# Altium schematic sheet top.SchDoc
size A3
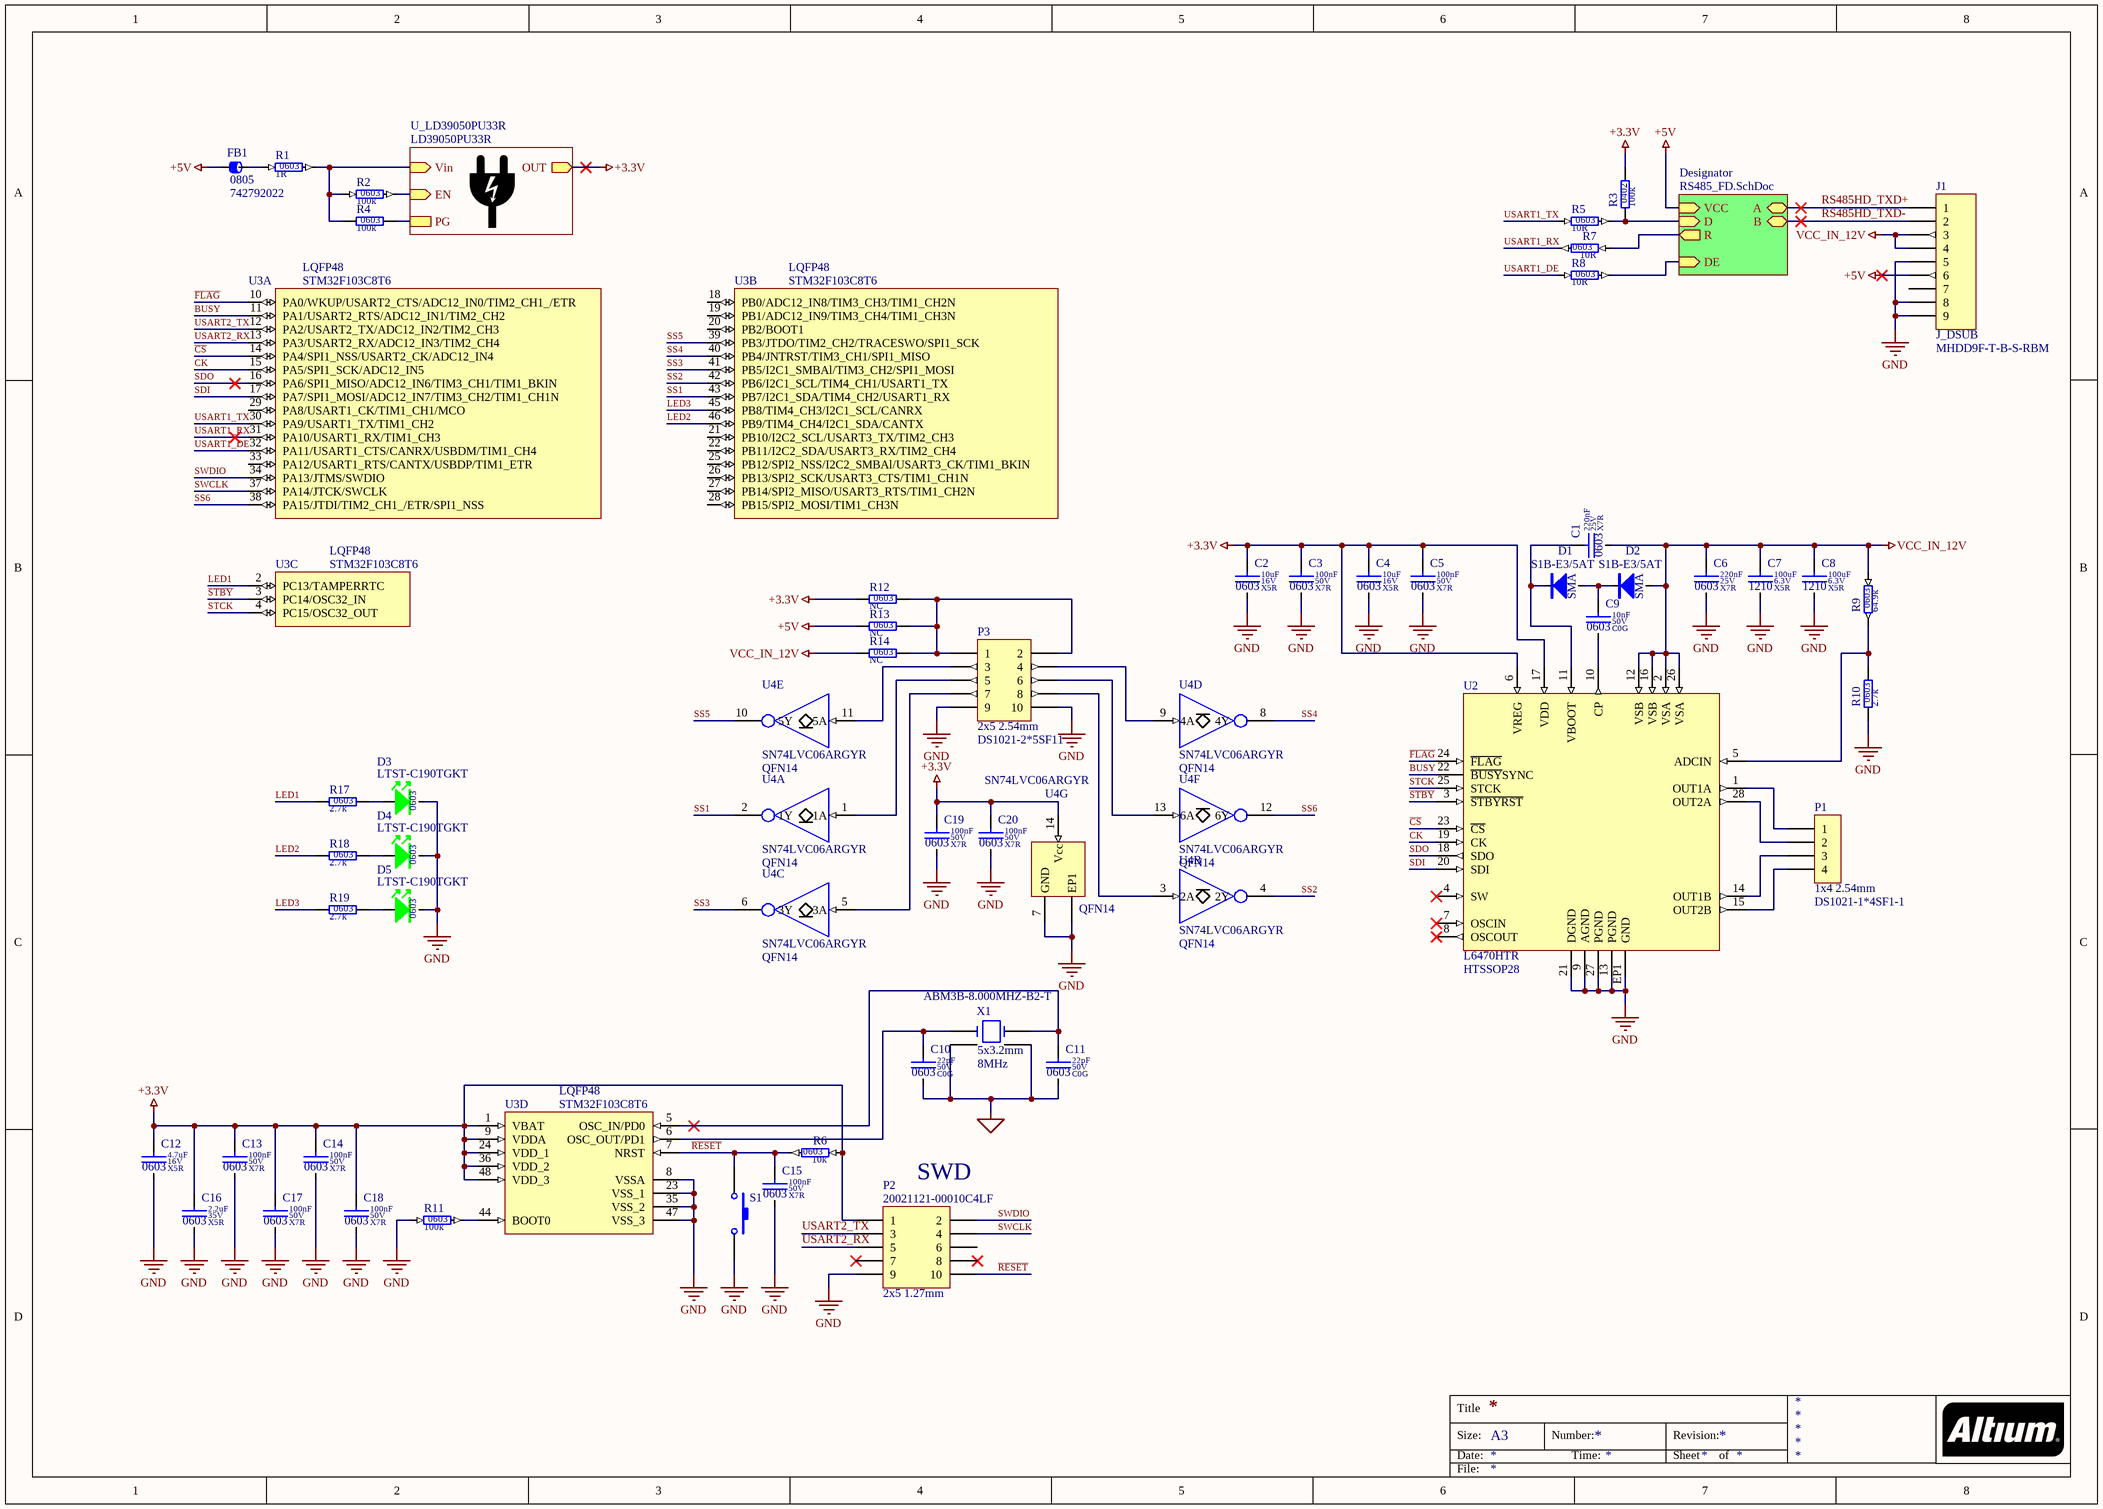
[diagram p0: top.SchDoc]

## Parts
C1  value 220nF  Dielectric: X7R  Voltage: 25V  SCH_Footprint: 0603  [C_0603_1608]  (hidden comment: Ceramic X7R)
C2  value 10uF  Dielectric: X5R  Voltage: 16V  SCH_Footprint: 0603  [C_0603_1608]  (hidden comment: Ceramic X5R)
C3  value 100nF  Dielectric: X7R  Voltage: 50V  SCH_Footprint: 0603  [C_0603_1608]  (hidden comment: Ceramic X7R)
C4  value 10uF  Dielectric: X5R  Voltage: 16V  SCH_Footprint: 0603  [C_0603_1608]  (hidden comment: Ceramic X5R)
C5  value 100nF  Dielectric: X7R  Voltage: 50V  SCH_Footprint: 0603  [C_0603_1608]  (hidden comment: Ceramic X7R)
C6  value 220nF  Dielectric: X7R  Voltage: 25V  SCH_Footprint: 0603  [C_0603_1608]  (hidden comment: Ceramic X7R)
C7  value 100uF  Dielectric: X5R  Voltage: 6.3V  SCH_Footprint: 1210  [C_1210_3225]  (hidden comment: Ceramic X5R)
C8  value 100uF  Dielectric: X5R  Voltage: 6.3V  SCH_Footprint: 1210  [C_1210_3225]  (hidden comment: Ceramic X5R)
C9  value 10nF  Dielectric: C0G  Voltage: 50V  SCH_Footprint: 0603  [C_0603_1608]  (hidden comment: Ceramic C0G)
C10  value 22pF  Dielectric: C0G  Voltage: 50V  SCH_Footprint: 0603  [C_0603_1608]  (hidden comment: Ceramic C0G)
C11  value 22pF  Dielectric: C0G  Voltage: 50V  SCH_Footprint: 0603  [C_0603_1608]  (hidden comment: Ceramic C0G)
C12  value 4.7uF  Dielectric: X5R  Voltage: 16V  SCH_Footprint: 0603  [C_0603_1608]  (hidden comment: Ceramic X5R)
C13  value 100nF  Dielectric: X7R  Voltage: 50V  SCH_Footprint: 0603  [C_0603_1608]  (hidden comment: Ceramic X7R)
C14  value 100nF  Dielectric: X7R  Voltage: 50V  SCH_Footprint: 0603  [C_0603_1608]  (hidden comment: Ceramic X7R)
C15  value 100nF  Dielectric: X7R  Voltage: 50V  SCH_Footprint: 0603  [C_0603_1608]  (hidden comment: Ceramic X7R)
C16  value 2.2uF  Dielectric: X5R  Voltage: 35V  SCH_Footprint: 0603  [C_0603_1608]  (hidden comment: Ceramic X5R)
C17  value 100nF  Dielectric: X7R  Voltage: 50V  SCH_Footprint: 0603  [C_0603_1608]  (hidden comment: Ceramic X7R)
C18  value 100nF  Dielectric: X7R  Voltage: 50V  SCH_Footprint: 0603  [C_0603_1608]  (hidden comment: Ceramic X7R)
C19  value 100nF  Dielectric: X7R  Voltage: 50V  SCH_Footprint: 0603  [C_0603_1608]  (hidden comment: Ceramic X7R)
C20  value 100nF  Dielectric: X7R  Voltage: 50V  SCH_Footprint: 0603  [C_0603_1608]  (hidden comment: Ceramic X7R)
D1  value S1B-E3/5AT  SCH_Footprint: SMA  [SMA_DO-214AC]  (hidden comment: S1B-E3)
D2  value S1B-E3/5AT  SCH_Footprint: SMA  [SMA_DO-214AC]  (hidden comment: S1B-E3)
D3  value LTST-C190TGKT  SCH_Footprint: 0603  [OL_0603_1608]  (hidden comment: Green Led)
D4  value LTST-C190TGKT  SCH_Footprint: 0603  [OL_0603_1608]  (hidden comment: Green Led)
D5  value LTST-C190TGKT  SCH_Footprint: 0603  [OL_0603_1608]  (hidden comment: Green Led)
FB1  value 742792022  SCH_Footprint: 0805  [FB_0805_2012]  (hidden comment: Ferrite bead)
J1  value MHDD9F-T-B-S-RBM  [J_DSUB_MHDD9F-T-B-S-RBM]  (hidden comment: DSUB 9 Pin)
P1  value DS1021-1*4SF1-1  SCH_Footprint: 1x4 2.54mm  [P_HEADER_1x4_2.54]  (hidden comment: Goldpin)
P2  value 20021121-00010C4LF  SCH_Footprint: 2x5 1.27mm  [P_HEADER_2x5_1.27]  (hidden comment: Jtag)
P3  value DS1021-2*5SF11  SCH_Footprint: 2x5 2.54mm  [P_HEADER_2x5_2.54]  (hidden comment: Goldpin male)
R1  value 1R  SCH_Footprint: 0603  [R_0603_1608]  (hidden comment: Resistor)
R2  value 100k  SCH_Footprint: 0603  [R_0603_1608]  (hidden comment: Resistor)
R3  value 100k  SCH_Footprint: 0402  [R_0402_1005]  (hidden comment: Resistor)
R4  value 100k  SCH_Footprint: 0603  [R_0603_1608]  (hidden comment: Resistor)
R5  value 10R  SCH_Footprint: 0603  [R_0603_1608]  (hidden comment: Resistor)
R6  value 10k  SCH_Footprint: 0603  [R_0603_1608]  (hidden comment: Resistor)
R7  value 10R  SCH_Footprint: 0603  [R_0603_1608]  (hidden comment: Resistor)
R8  value 10R  SCH_Footprint: 0603  [R_0603_1608]  (hidden comment: Resistor)
R9  value 64.9k  SCH_Footprint: 0603  [R_0603_1608]  (hidden comment: Resistor)
R10  value 2.7k  SCH_Footprint: 0603  [R_0603_1608]  (hidden comment: Resistor)
R11  value 100k  SCH_Footprint: 0603  [R_0603_1608]  (hidden comment: Resistor)
R12  value NC  SCH_Footprint: 0603  [R_NC_0603_1608]  (hidden comment: Resistor)
R13  value NC  SCH_Footprint: 0603  [R_NC_0603_1608]  (hidden comment: Resistor)
R14  value NC  SCH_Footprint: 0603  [R_NC_0603_1608]  (hidden comment: Resistor)
R17  value 2.7k  SCH_Footprint: 0603  [R_0603_1608]  (hidden comment: Resistor)
R18  value 2.7k  SCH_Footprint: 0603  [R_0603_1608]  (hidden comment: Resistor)
R19  value 2.7k  SCH_Footprint: 0603  [R_0603_1608]  (hidden comment: Resistor)
S1  3x6mm  [S_TACTSWITCH3x6]  (value not drawn)
U2  value L6470HTR  [HTSSOP28]  (hidden comment: Fully integrated microstepping motor driver with motion engine and SPI)
U3  SCH_Footprint: LQFP48  [LQFP48_7x7]  (hidden comment: STM32F103C8T6)  (parts A,B,C,D of 4)
U4  value SN74LVC06ARGYR  SCH_Footprint: QFN14  [QFN14_4x4]  (hidden comment: Open drain buffer)  (parts A,B,C,D,E,F,G of 7)
X1  Manufacturer Part Number: ABM3B-8.000MHZ-B2-T  SCH_Footprint: 5x3.2mm  [X_ABM3B_5X3X11]  (hidden comment: 8MHz)

## Sub-sheets
Designator = RS485_FD.SchDoc: VCC (in), R (out), D (in), DE (in), A (bidir), B (bidir)
U_LD39050PU33R = LD39050PU33R: Vin (in), OUT (out), PG, EN (in)

## Nets
+3.3V: C2.1 C3.1 C4.1 C5.1 C12.1 C13.1 C14.1 C16.1 C17.1 C18.1 C19.1 C20.1 P2.1 R3.2 R6.1 R12.1 U2.6(VREG) U2.17(VDD) U3.1(VBAT) U3.9(VDDA) U3.24(VDD_1) U3.36(VDD_2) U3.48(VDD_3) U4.14(Vcc) ; sheet U_LD39050PU33R/OUT
+5V: FB1.1 J1.6 R13.1 ; sheet Designator/VCC
GND: C2.2 C3.2 C4.2 C5.2 C6.2 C7.2 C8.2 C10.2 C11.2 C12.2 C13.2 C14.2 C15.2 C16.2 C17.2 C18.2 C19.2 C20.2 D3.1(K) D4.1(K) D5.1(K) J1.5 J1.8 J1.9 P2.9 P3.9 P3.10 R10.1 R11.1 S1.2 U2.9(AGND) U2.13(PGND) U2.21(DGND) U2.27(PGND) U2.EP1(GND) U3.8(VSSA) U3.23(VSS_1) U3.35(VSS_2) U3.47(VSS_3) U4.7(GND) U4.EP1 X1.2(GND) X1.4(GND)
VCC_IN_12V: C1.2 C6.1 C7.1 C8.1 D2.2 J1.3 J1.4 R9.2 R14.1 U2.2(VSA) U2.12(VSB) U2.16(VSB) U2.26(VSA)
BUSY: U2.22(~{BUSY}SYNC) U3.11(PA1/USART2_RTS/ADC12_IN1/TIM2_CH2)
~{CS}: U2.23(~{CS}) U3.14(PA4/SPI1_NSS/USART2_CK/ADC12_IN4)
CK: U2.19(CK) U3.15(PA5/SPI1_SCK/ADC12_IN5)
~{FLAG}: U2.24(~{FLAG}) U3.10(PA0/WKUP/USART2_CTS/ADC12_IN0/TIM2_CH1_/ETR)
LED1: R17.1 U3.2(PC13/TAMPERRTC)
LED2: R18.1 U3.46(PB9/TIM4_CH4/I2C1_SDA/CANTX)
LED3: R19.1 U3.45(PB8/TIM4_CH3/I2C1_SCL/CANRX)
~{RESET}: C15.1 P2.10 R6.2 S1.1 U3.7(NRST)
RS485HD_TXD+: J1.1 ; sheet Designator/A
RS485HD_TXD-: J1.2 ; sheet Designator/B
~{STBY}: U2.3(~{STBY}~{RST}) U3.3(PC14/OSC32_IN)
SDI: U2.20(SDI) U3.17(PA7/SPI1_MOSI/ADC12_IN7/TIM3_CH2/TIM1_CH1N)
SDO: U2.18(SDO) U3.16(PA6/SPI1_MISO/ADC12_IN6/TIM3_CH1/TIM1_BKIN)
SS1: U3.43(PB7/I2C1_SDA/TIM4_CH2/USART1_RX) U4.2(1Y)
SS2: U3.42(PB6/I2C1_SCL/TIM4_CH1/USART1_TX) U4.4(2Y)
SS3: U3.41(PB5/I2C1_SMBAl/TIM3_CH2/SPI1_MOSI) U4.6(3Y)
SS4: U3.40(PB4/JNTRST/TIM3_CH1/SPI1_MISO) U4.8(4Y)
SS5: U3.39(PB3/JTDO/TIM2_CH2/TRACESWO/SPI1_SCK) U4.10(5Y)
SS6: U3.38(PA15/JTDI/TIM2_CH1_/ETR/SPI1_NSS) U4.12(6Y)
STCK: U2.25(STCK) U3.4(PC15/OSC32_OUT)
SWCLK: P2.4 U3.37(PA14/JTCK/SWCLK)
SWDIO: P2.2 U3.34(PA13/JTMS/SWDIO)
USART1_DE: R8.1 U3.32(PA11/USART1_CTS/CANRX/USBDM/TIM1_CH4)
USART1_RX: R7.2 U3.31(PA10/USART1_RX/TIM1_CH3)
USART1_TX: R5.1 U3.30(PA9/USART1_TX/TIM1_CH2)
USART2_RX: P2.5 U3.13(PA3/USART2_RX/ADC12_IN3/TIM2_CH4)
USART2_TX: P2.3 U3.12(PA2/USART2_TX/ADC12_IN2/TIM2_CH3)
NetC1_1: C1.1 D1.1 U2.11(VBOOT)
NetC9_1: C9.1 D1.2 D2.1
NetC9_2: C9.2 U2.10(CP)
NetC10_1: C10.1 U3.6(OSC_OUT/PD1) X1.3
NetC11_1: C11.1 U3.5(OSC_IN/PD0) X1.1
NetD3_2: D3.2(A) R17.2
NetD4_2: D4.2(A) R18.2
NetD5_2: D5.2(A) R19.2
NetFB1_2: FB1.2 R1.1
NetP1_1: P1.1 U2.1(OUT1A)
NetP1_2: P1.2 U2.28(OUT2A)
NetP1_3: P1.3 U2.14(OUT1B)
NetP1_4: P1.4 U2.15(OUT2B)
NetP3_1: P3.1 P3.2 R12.2 R13.2 R14.2
NetP3_3: P3.3 U4.11(5A)
NetP3_4: P3.4 U4.9(4A)
NetP3_5: P3.5 U4.1(1A)
NetP3_6: P3.6 U4.13(6A)
NetP3_7: P3.7 U4.5(3A)
NetP3_8: P3.8 U4.3(2A)
NetR1_2: R1.2 R2.1 R4.1 ; sheet U_LD39050PU33R/Vin
NetR2_2: R2.2 ; sheet U_LD39050PU33R/EN
NetR3_1: R3.1 R5.2 ; sheet Designator/D
NetR4_2: R4.2 ; sheet U_LD39050PU33R/PG
NetR7_1: R7.1 ; sheet Designator/R
NetR8_2: R8.2 ; sheet Designator/DE
NetR9_1: R9.1 R10.2 U2.5(ADCIN)
NetR11_2: R11.2 U3.44(BOOT0)

Not connected (* = marked no-connect by the designer): J1 0(NC) 7; P2 6 7* 8*; U2 4(SW)* 7(OSCIN)* 8(OSCOUT)*; U3 18(PB0/ADC12_IN8/TIM3_CH3/TIM1_CH2N) 19(PB1/ADC12_IN9/TIM3_CH4/TIM1_CH3N) 20(PB2/BOOT1) 21(PB10/I2C2_SCL/USART3_TX/TIM2_CH3) 22(PB11/I2C2_SDA/USART3_RX/TIM2_CH4) 25(PB12/SPI2_NSS/I2C2_SMBAl/USART3_CK/TIM1_BKIN) 26(PB13/SPI2_SCK/USART3_CTS/TIM1_CH1N) 27(PB14/SPI2_MISO/USART3_RTS/TIM1_CH2N) 28(PB15/SPI2_MOSI/TIM1_CH3N) 29(PA8/USART1_CK/TIM1_CH1/MCO) 33(PA12/USART1_RTS/CANTX/USBDP/TIM1_ETR)

## Notes on the sheet
- (near P2) SWD
- Title
- Size:
- Date:
- A3
- Number:
- Time:
- Revision:
- Sheet
- of
- File:

## Library data of the parts
C1 C6 = C_220nF_25V_X7R_0603_10: Capacitor; Manufacturer: Murata; Manufacturer Part Number: GCM188R71E224KA55D; Tolerance (%): 10; Part Number: C_220nF_25V_X7R_0603_10; HelpURL: http://psearch.en.murata.com/capacitor/product/GCM188R71E224KA55%23.pdf; Supplier 1: TME; Supplier Part Number 1: GCM188R71E224KA55D; Supplier 2: RS Components; Supplier Part Number 2: 7234976; Supplier 3: Farnell; Supplier Part Number 3: 2688625; Supplier 4: Mouser; Supplier Part Number 4: 81-GCM188R71E224K55D; Supplier 5: Digi-Key; Supplier Part Number 5: 490-4935-1-ND
C2 C4 = C_10uF_16V_X5R_0603_20: Capacitor; Manufacturer: Samsung Electro-Mechanics; Manufacturer Part Number: CL10A106MO8NQNC; Tolerance (%): 20; Part Number: C_10uF_16V_X5R_0603_20; HelpURL: http://www.tme.eu/pl/Document/4a42202b32dab16128fe107dd69598cc/samsung-chip-cap.pdf; Supplier 1: TME; Supplier Part Number 1: CL10A106MO8NQNC; Supplier 2: RS Components; Supplier 3: Farnell; Supplier 4: Mouser; Supplier 5: Digi-Key
C3 C5 C13-C15 C17-C20 = C_100nF_50V_X7R_0603_5: Capacitor; Manufacturer: Samsung; Manufacturer Part Number: CL10B104JB8NNNC; Tolerance (%): 5; Part Number: C_100nF_50V_X7R_0603_5; HelpURL: http://www.tme.eu/pl/Document/4a42202b32dab16128fe107dd69598cc/samsung-chip-cap.pdf; Supplier 1: TME; Supplier Part Number 1: CL10B104JB8NNNC; Supplier 2: RS Components; Supplier 3: Farnell; Supplier 4: Mouser; Supplier 5: Digi-Key
C7 C8 = C_100uF_6.3V_X5R_1210_20: Capacitor; Manufacturer: TDK; Manufacturer Part Number: C3225X5R0J107M250AC; Tolerance (%): 20; Part Number: C_100uF_6.3V_X5R_1210_20; HelpURL: https://datasheet.octopart.com/C3225X5R0J107M250AC-TDK-datasheet-41194876.pdf; Supplier 1: TME; Supplier 2: RS Components; Supplier Part Number 2: 7407685P; Supplier 3: Farnell; Supplier Part Number 3: 2522162; Supplier 4: Mouser; Supplier Part Number 4: 810-C3225X5R0J107M; Supplier 5: Digi-Key; Supplier Part Number 5: 445-1437-1-ND
C9 = C_10nF_50V_C0G_0603_5: Capacitor; Manufacturer: Murata; Manufacturer Part Number: GRM1885C1H103JA01D; Tolerance (%): 5; Part Number: C_10nF_50V_C0G_0603_5; HelpURL: https://datasheet.octopart.com/GRM1885C1H103JA01D-Murata-datasheet-34231350.pdf; Supplier 1: TME; Supplier Part Number 1: GRM1885C1H103JA01D; Supplier 2: RS Components; Supplier Part Number 2: 144-9032; Supplier 3: Farnell; Supplier Part Number 3: 2456107; Supplier 4: Mouser; Supplier Part Number 4: 81-GRM1885C1H103JA1D; Supplier 5: Digi-Key; Supplier Part Number 5: 490-9666-1-ND
C10 C11 = C_22pF_50V_C0G_0603_5: Capacitor; Manufacturer: AVX; Manufacturer Part Number: 06035A220JAT2A; Tolerance (%): 5; Part Number: C_22pF_50V_C0G_0603_5; HelpURL: https://datasheet.octopart.com/06035A220JAT2A-AVX-datasheet-9883399.pdf; Supplier 1: TME; Supplier 2: RS Components; Supplier Part Number 2: 1349628; Supplier 3: Farnell; Supplier Part Number 3: 2280861; Supplier 4: Mouser; Supplier Part Number 4: 581-06035A220J; Supplier 5: Digi-Key; Supplier Part Number 5: 478-1167-1-ND
C12 = C_4.7uF_16V_X5R_0603_10: Capacitor; Manufacturer: Murata; Manufacturer Part Number: GRM188R61C475KAAJD; Tolerance (%): 10; Part Number: C_4.7uF_16V_X5R_0603_10; HelpURL: https://datasheet.octopart.com/GRM188R61C475KAAJD-Murata-datasheet-66077093.pdf; Supplier 1: TME; Supplier 2: RS Components; Supplier Part Number 2: 884-7264P; Supplier 3: Farnell; Supplier Part Number 3: 2611924; Supplier 4: Mouser; Supplier Part Number 4: 81-GRM188R61C475KAJD; Supplier 5: Digi-Key; Supplier Part Number 5: 490-10481-2-ND
C16 = C_2.2uF_35V_X5R_0603_10: Capacitor; Manufacturer: Murata; Manufacturer Part Number: GRM188R6YA225KA12D; Tolerance (%): 10; Part Number: C_2.2uF_35V_X5R_0603_10; HelpURL: https://datasheet.octopart.com/GRM188R6YA225KA12D-Murata-datasheet-66077095.pdf; Supplier 1: TME; Supplier 2: RS Components; Supplier Part Number 2: 8151358; Supplier 3: Farnell; Supplier Part Number 3: 2611926; Supplier 4: Mouser; Supplier Part Number 4: 81-GRM188R6YA225KA2D; Supplier 5: Digi-Key; Supplier Part Number 5: 490-7204-1-ND
D1 D2 = D_S1BE3/61T_1A_100V_SMA: Manufacturer: Vishay; Voltage: 100V; Current: 1A; Part Number: D_S1BE3/61T_1A_100V_SMA; HelpURL: https://www.verical.com/datasheet/vishay-rectifier-s1be3-61t-768273.pdf; Manufacturer Part Number: S1B-E3/5AT; Supplier 1: TME; Supplier 2: RS Components; Supplier 3: Farnell; Supplier Part Number 3: 9550224; Supplier 4: Mouser; Supplier Part Number 4: 625-S1B-E3/5AT; Supplier 5: Digi-Key; Supplier Part Number 5: S1B-E3/5AT-ND
D3-D5 = OL_G_0603: LED GREEN; Manufacturer: Lite-On; Part Number: OL_G_0603; HelpURL: https://datasheet.octopart.com/LTST-C190TGKT-Lite-On-datasheet-158437.pdf; Manufacturer Part Number: LTST-C190TGKT; Supplier 1: TME; Supplier Part Number 1: LTST-C190TGKT; Supplier 2: RS Components; Supplier Part Number 2: 6920997P; Supplier 3: Farnell; Supplier 4: Mouser; Supplier Part Number 4: 859-LTST-C190TGKT; Supplier 5: Digi-Key; Supplier Part Number 5: 160-2019-1-ND
FB1 = FB_742792022: Manufacturer: Wurth; Current: 2A; Resistance: 50mR; Part Number: FB_742792022; HelpURL: http://www.farnell.com/datasheets/1919973.pdf?_ga=2.197269935.1851800069.1516124392-930414557.1508304960; Manufacturer Part Number: 742792022; Supplier 1: TME; Supplier 2: RS Components; Supplier 3: Farnell; Supplier Part Number 3: 1635733; Supplier 4: Mouser; Supplier 5: Digi-Key
J1 = J_DSUB: Header, 9-Pin; SCH_Footprint: J_DSUB; Part Number: J_DSUB; Component Type: Standard; HelpURL: https://www.tme.eu/Document/d24efe21bdaa08410b5ca50a678e1de1/MHDDXX-F-T-B-S-RBM.PDF; Manufacturer: -; Manufacturer Part Number: MHDD9F-T-B-S-RBM; Supplier 1: TME; Supplier Part Number 1: MHDD9F-T-B-S-RBM; Supplier 2: RS Components; Supplier 3: Farnell; Supplier Part Number 3: 2533067; Supplier 4: Mouser; Supplier 5: Digi-Key
P1 = P_HEADER_1x4_2.54: Pin Header; Manufacturer: Connfly; Part Number: P_HEADER_1x4_2.54; Component Type: Standard; HelpURL: http://datasheet.octopart.com/DS1021-1%2A4SF1-1-Connfly-datasheet-65537859.pdf; Manufacturer Part Number: DS1021-1*4SF1-1; Supplier 1: TME; Supplier Part Number 1: ZL201-04G; Supplier 2: RS Components; Supplier 3: Farnell; Supplier 4: Mouser; Supplier 5: Digi-Key
P2 = P_HEADER_2x5_1.27: Header, 10-Pin, Dual row; Manufacturer: FCI; Part Number: P_HEADER_2x5_1.27; Component Type: Standard; HelpURL: http://www.mouser.com/catalog/645/usd/1591.pdf; Manufacturer Part Number: 20021121-00010C4LF; Supplier 1: TME; Supplier Part Number 1: 20021121-00010C4LF; Supplier 2: RS Components; Supplier Part Number 2: 794-4584; Supplier 3: Farnell; Supplier Part Number 3: 1865279; Supplier 4: Mouser; Supplier Part Number 4: 649-202112100010C4LF; Supplier 5: Digi-Key; Supplier Part Number 5: 609-3695-1-ND
P3 = P_HEADER_2x5_2.54: Pin Header; Manufacturer: Connfly; Part Number: P_HEADER_2x5_2.54; Component Type: Standard; HelpURL: https://www.tme.eu/Document/cc301e58a5da78cb543a94b5a5b7f06a/DS1021.pdf; Manufacturer Part Number: DS1021-2*5SF11; Supplier 1: TME; Supplier Part Number 1: ZL202-10G; Supplier 2: RS Components; Supplier 3: Farnell; Supplier 4: Mouser; Supplier 5: Digi-Key
R1 = R_1R_0603_1: Manufacturer: Yageo; Manufacturer Part Number: RC0603FR-071RL; Voltage: 50V; Power: 100mW; Tolerance: 1%; Part Number: R_1R_0603_1; HelpURL: http://www.tme.eu/en/Document/9fef8ccbb584e9f6a1c931cf356afd5c/PYu-RC0603_51_RoHS_L_4.pdf; Supplier 1: TME; Supplier Part Number 1: RC0603FR-071R; Supplier 2: RS Components; Supplier 3: Farnell; Supplier Part Number 3: 9238123; Supplier 4: Mouser; Supplier Part Number 4: 603-RC0603FR-071RL; Supplier 5: Digi-Key; Supplier Part Number 5: 311-1.00HRCT-ND
R2 R4 R11 = R_100k_0603_1: Manufacturer: Royalohm; Manufacturer Part Number: 0603SAF1003T5E; Voltage: 50V; Power: 100mW; Tolerance: 1%; Part Number: R_100k_0603_1; HelpURL: http://www.tme.eu/pl/Document/b315665a56acbc42df513c99b390ad98/ROYALOHM-THICKFILM.pdf; Supplier 1: TME; Supplier Part Number 1: SMD0603-100K-1%; Supplier 2: RS Components; Supplier 3: Farnell; Supplier 4: Mouser; Supplier Part Number 4: 667-ERJ-3EKF1003V; Supplier 5: Digi-Key; Supplier Part Number 5: P100KHCT-ND
R3 = R_100k_0402_1: Manufacturer: Yageo; Manufacturer Part Number: RC0402FR-07100KL; Voltage: 50V; Power: 63mW; Tolerance: 1%; Part Number: R_100k_0402_1; HelpURL: http://www.tme.eu/pl/Document/1a2bc76e2be68b3b1670068306778ce6/rc0402yageo.pdf; Supplier 1: TME; Supplier Part Number 1: RC0402FR-07100K; Supplier 2: RS Components; Supplier 3: Farnell; Supplier Part Number 3: 2131798; Supplier 4: Mouser; Supplier Part Number 4: 603-RC0402FR-07100KL; Supplier 5: Digi-Key; Supplier Part Number 5: 311-100KLRCT-ND
R5 R7 R8 = R_10R_0603_1: Manufacturer: Royalohm; Manufacturer Part Number: 0603SAF100JT5E; Voltage: 50V; Power: 100mW; Tolerance: 1%; Part Number: R_10R_0603_1; HelpURL: http://www.tme.eu/pl/Document/b315665a56acbc42df513c99b390ad98/ROYALOHM-THICKFILM.pdf; Supplier 1: TME; Supplier Part Number 1: SMD0603-10R-1%; Supplier 2: RS Components; Supplier 3: Farnell; Supplier 4: Mouser; Supplier 5: Digi-Key
R6 = R_10k_0603_1: Manufacturer: Vishay; Manufacturer Part Number: CRCW060310K0FKTABC; Voltage: 75V; Power: 100mW; Tolerance: 1%; Part Number: R_10k_0603_1; HelpURL: http://www.tme.eu/pl/Document/622e28308c06d160637f2b14751ba16b/Data%20Sheet%20CRCW_BCe3.pdf; Supplier 1: TME; Supplier Part Number 1: CRCW060310K0FKTABC; Supplier 2: RS Components; Supplier 3: Farnell; Supplier 4: Mouser; Supplier Part Number 4: 667-ERJ-3EKF1002V; Supplier 5: Digi-Key; Supplier Part Number 5: P10KGCT-ND
R9 = R_64.9k_0603_1: Manufacturer: Panasonic; Manufacturer Part Number: ERJ-3EKF6492V; Voltage: 75V; Power: 100mW; Tolerance: 1%; Part Number: R_64.9k_0603_1; HelpURL: https://industrial.panasonic.com/cdbs/www-data/pdf/RDA0000/AOA0000C304.pdf; Supplier 1: TME; Supplier 2: RS Components; Supplier Part Number 2: 1229382; Supplier 3: Farnell; Supplier Part Number 3: 2059481; Supplier 4: Mouser; Supplier Part Number 4: 667-ERJ-3EKF6492V; Supplier 5: Digi-Key; Supplier Part Number 5: P64.9KHCT-ND
R10 R17-R19 = R_2.7k_0603_1: Manufacturer: Royalohm; Manufacturer Part Number: 0603SAF2701T5E; Voltage: 50V; Power: 100mW; Tolerance: 1%; Part Number: R_2.7k_0603_1; HelpURL: http://www.tme.eu/pl/Document/b315665a56acbc42df513c99b390ad98/ROYALOHM-THICKFILM.pdf; Supplier 1: TME; Supplier Part Number 1: SMD0603-2K7-1%; Supplier 2: RS Components; Supplier 3: Farnell; Supplier 4: Mouser; Supplier 5: Digi-Key
R12-R14 = R_GENERIC_0603: Part Number: R_GENERIC_0603; Supplier 1: TME; Supplier 2: RS Components; Supplier 3: Farnell; Supplier 4: Mouser; Supplier 5: Digi-Key
S1 = S_TACTSWITCH: Tact Switch; Manufacturer: Ninigi; Manufacturer Part Number: TACTM-34N-F; Part Number: S_TACTSWITCH; HelpURL: http://pl.ninigi.com/product/tactm-34n-f/pdf; Supplier 1: TME; Supplier Part Number 1: TACTM-34N-F; Supplier 2: RS Components; Supplier 3: Farnell; Supplier 4: Mouser; Supplier 5: Digi-Key
U2 = U_L6470HTR: Manufacturer: STMicroelectronics; SCH_Footprint: HTSSOP28; Part Number: U_L6470HTR; HelpURL: https://pl.mouser.com/datasheet/2/389/l6470-1849602.pdf; Manufacturer Part Number: L6470HTR; Supplier 1: TME; Supplier 2: RS Components; Supplier 3: Farnell; Supplier Part Number 3: 2806876; Supplier 4: Mouser; Supplier Part Number 4: 511-L6470HTR; Supplier 5: Digi-Key; Supplier Part Number 5: 497-10812-1-ND
U3 = UP_STM32F103C8T6: Manufacturer: STMicroelectronics; Value: STM32F103C8T6; Part Number: UP_STM32F103C8T6; HelpURL: https://datasheet.octopart.com/STM32F103C8T6-STMicroelectronics-datasheet-48026265.pdf; Manufacturer Part Number: STM32F103C8T6; Supplier 1: TME; Supplier Part Number 1: STM32F103C8T6; Supplier 2: RS Components; Supplier Part Number 2: 1023545; Supplier 3: Farnell; Supplier Part Number 3: 1447637; Supplier 4: Mouser; Supplier Part Number 4: 511-STM32F103C8T6; Supplier 5: Digi-Key; Supplier Part Number 5: 497-6063-ND
U4 = U_SN74LVC06ARGYR: Manufacturer: Texas Instruments; Part Number: U_SN74LVC06ARGYR; HelpURL: http://www.ti.com/lit/ds/symlink/sn74lvc06a.pdf; Manufacturer Part Number: SN74LVC06ARGYR; Supplier 1: TME; Supplier 2: RS Components; Supplier 3: Farnell; Supplier 4: Mouser; Supplier Part Number 4: 595-SN74LVC06ARGYR; Supplier 5: Digi-Key; Supplier Part Number 5: 296-13957-1-ND
X1 = X_ABM3B-8.000MHZ-B2-T: Manufacturer: Abracon; Part Number: X_ABM3B-8.000MHZ-B2-T; Value: 8MHz; HelpURL: https://datasheet.octopart.com/ABM3B-8.000MHZ-B2-T-Abracon-datasheet-12510201.pdf; Supplier 1: TME; Supplier Part Number 1: ABM3B-8.000MHZ-B2; Supplier 2: RS Components; Supplier Part Number 2: 171-0644; Supplier 3: Farnell; Supplier Part Number 3: 2467818; Supplier 4: Mouser; Supplier Part Number 4: 815-ABM3B-8.0-B2-T; Supplier 5: Digi-Key; Supplier Part Number 5: 535-9720-1-ND